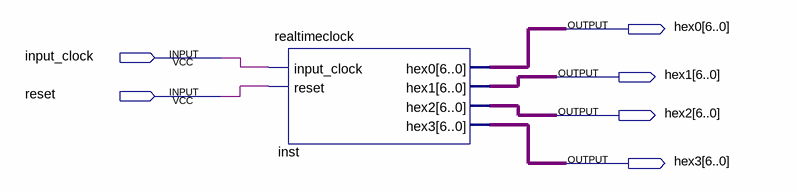
[diagram p0: schematic sheet]
// Quartus schematic TimeClock.bdf as structural Verilog: 1 symbols, 6 pins
module TimeClock (
  input  input_clock,
  input  reset,
  output [6:0] hex0,
  output [6:0] hex1,
  output [6:0] hex2,
  output [6:0] hex3
);

  realtimeclock inst (.input_clock(input_clock), .reset(reset), .hex0(hex0), .hex1(hex1), .hex2(hex2), .hex3(hex3));
endmodule
